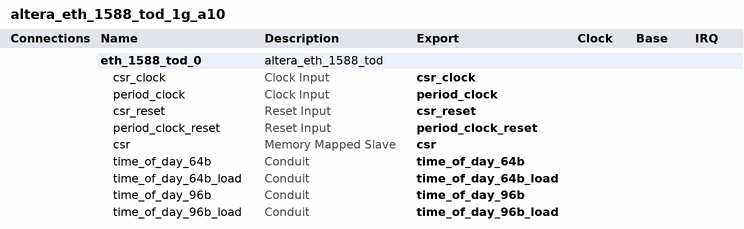
[diagram p0: system contents]
# Platform Designer (Qsys) system altera_eth_1588_tod_1g_a10, Arria 10 10AX115S3F45E2SGE3
# Parameters at their usual value, and those the tool derives, are not listed.
package require -exact qsys 16.1
create_system altera_eth_1588_tod_1g_a10
set_project_property DEVICE_FAMILY {Arria 10}
set_project_property DEVICE 10AX115S3F45E2SGE3

add_instance eth_1588_tod_0 altera_eth_1588_tod 16.1
set_instance_property eth_1588_tod_0 AUTO_EXPORT true
set_instance_parameter_value eth_1588_tod_0 DEFAULT_FNSEC_ADJPERIOD 0
set_instance_parameter_value eth_1588_tod_0 DEFAULT_FNSEC_PERIOD 0
set_instance_parameter_value eth_1588_tod_0 DEFAULT_NSEC_ADJPERIOD 8
set_instance_parameter_value eth_1588_tod_0 DEFAULT_NSEC_PERIOD 8
set_instance_parameter_value eth_1588_tod_0 OFFSET_JITTER_WANDER_EN 0
set_instance_parameter_value eth_1588_tod_0 PERIOD_CLOCK_FREQUENCY 1

# exported interfaces
add_interface csr avalon slave
set_interface_property csr EXPORT_OF eth_1588_tod_0.csr
add_interface csr_clock clock sink
set_interface_property csr_clock EXPORT_OF eth_1588_tod_0.csr_clock
add_interface csr_reset reset sink
set_interface_property csr_reset EXPORT_OF eth_1588_tod_0.csr_reset
add_interface period_clock clock sink
set_interface_property period_clock EXPORT_OF eth_1588_tod_0.period_clock
add_interface period_clock_reset reset sink
set_interface_property period_clock_reset EXPORT_OF eth_1588_tod_0.period_clock_reset
add_interface time_of_day_64b conduit end
set_interface_property time_of_day_64b EXPORT_OF eth_1588_tod_0.time_of_day_64b
add_interface time_of_day_64b_load conduit end
set_interface_property time_of_day_64b_load EXPORT_OF eth_1588_tod_0.time_of_day_64b_load
add_interface time_of_day_96b conduit end
set_interface_property time_of_day_96b EXPORT_OF eth_1588_tod_0.time_of_day_96b
add_interface time_of_day_96b_load conduit end
set_interface_property time_of_day_96b_load EXPORT_OF eth_1588_tod_0.time_of_day_96b_load

set_interconnect_requirement {$system} qsys_mm.clockCrossingAdapter HANDSHAKE
set_interconnect_requirement {$system} qsys_mm.enableEccProtection FALSE
set_interconnect_requirement {$system} qsys_mm.insertDefaultSlave FALSE
set_interconnect_requirement {$system} qsys_mm.maxAdditionalLatency 1

save_system altera_eth_1588_tod_1g_a10.qsys
